# EasyEDA schematic SCH_WatiBattery_2024-12-09.json
TITLE: Sheet_2; REV: 1.0; Date: 2024-12-09; Sheet: 1/1; Drawn By: thomas.fchrr03; Company: Your Company
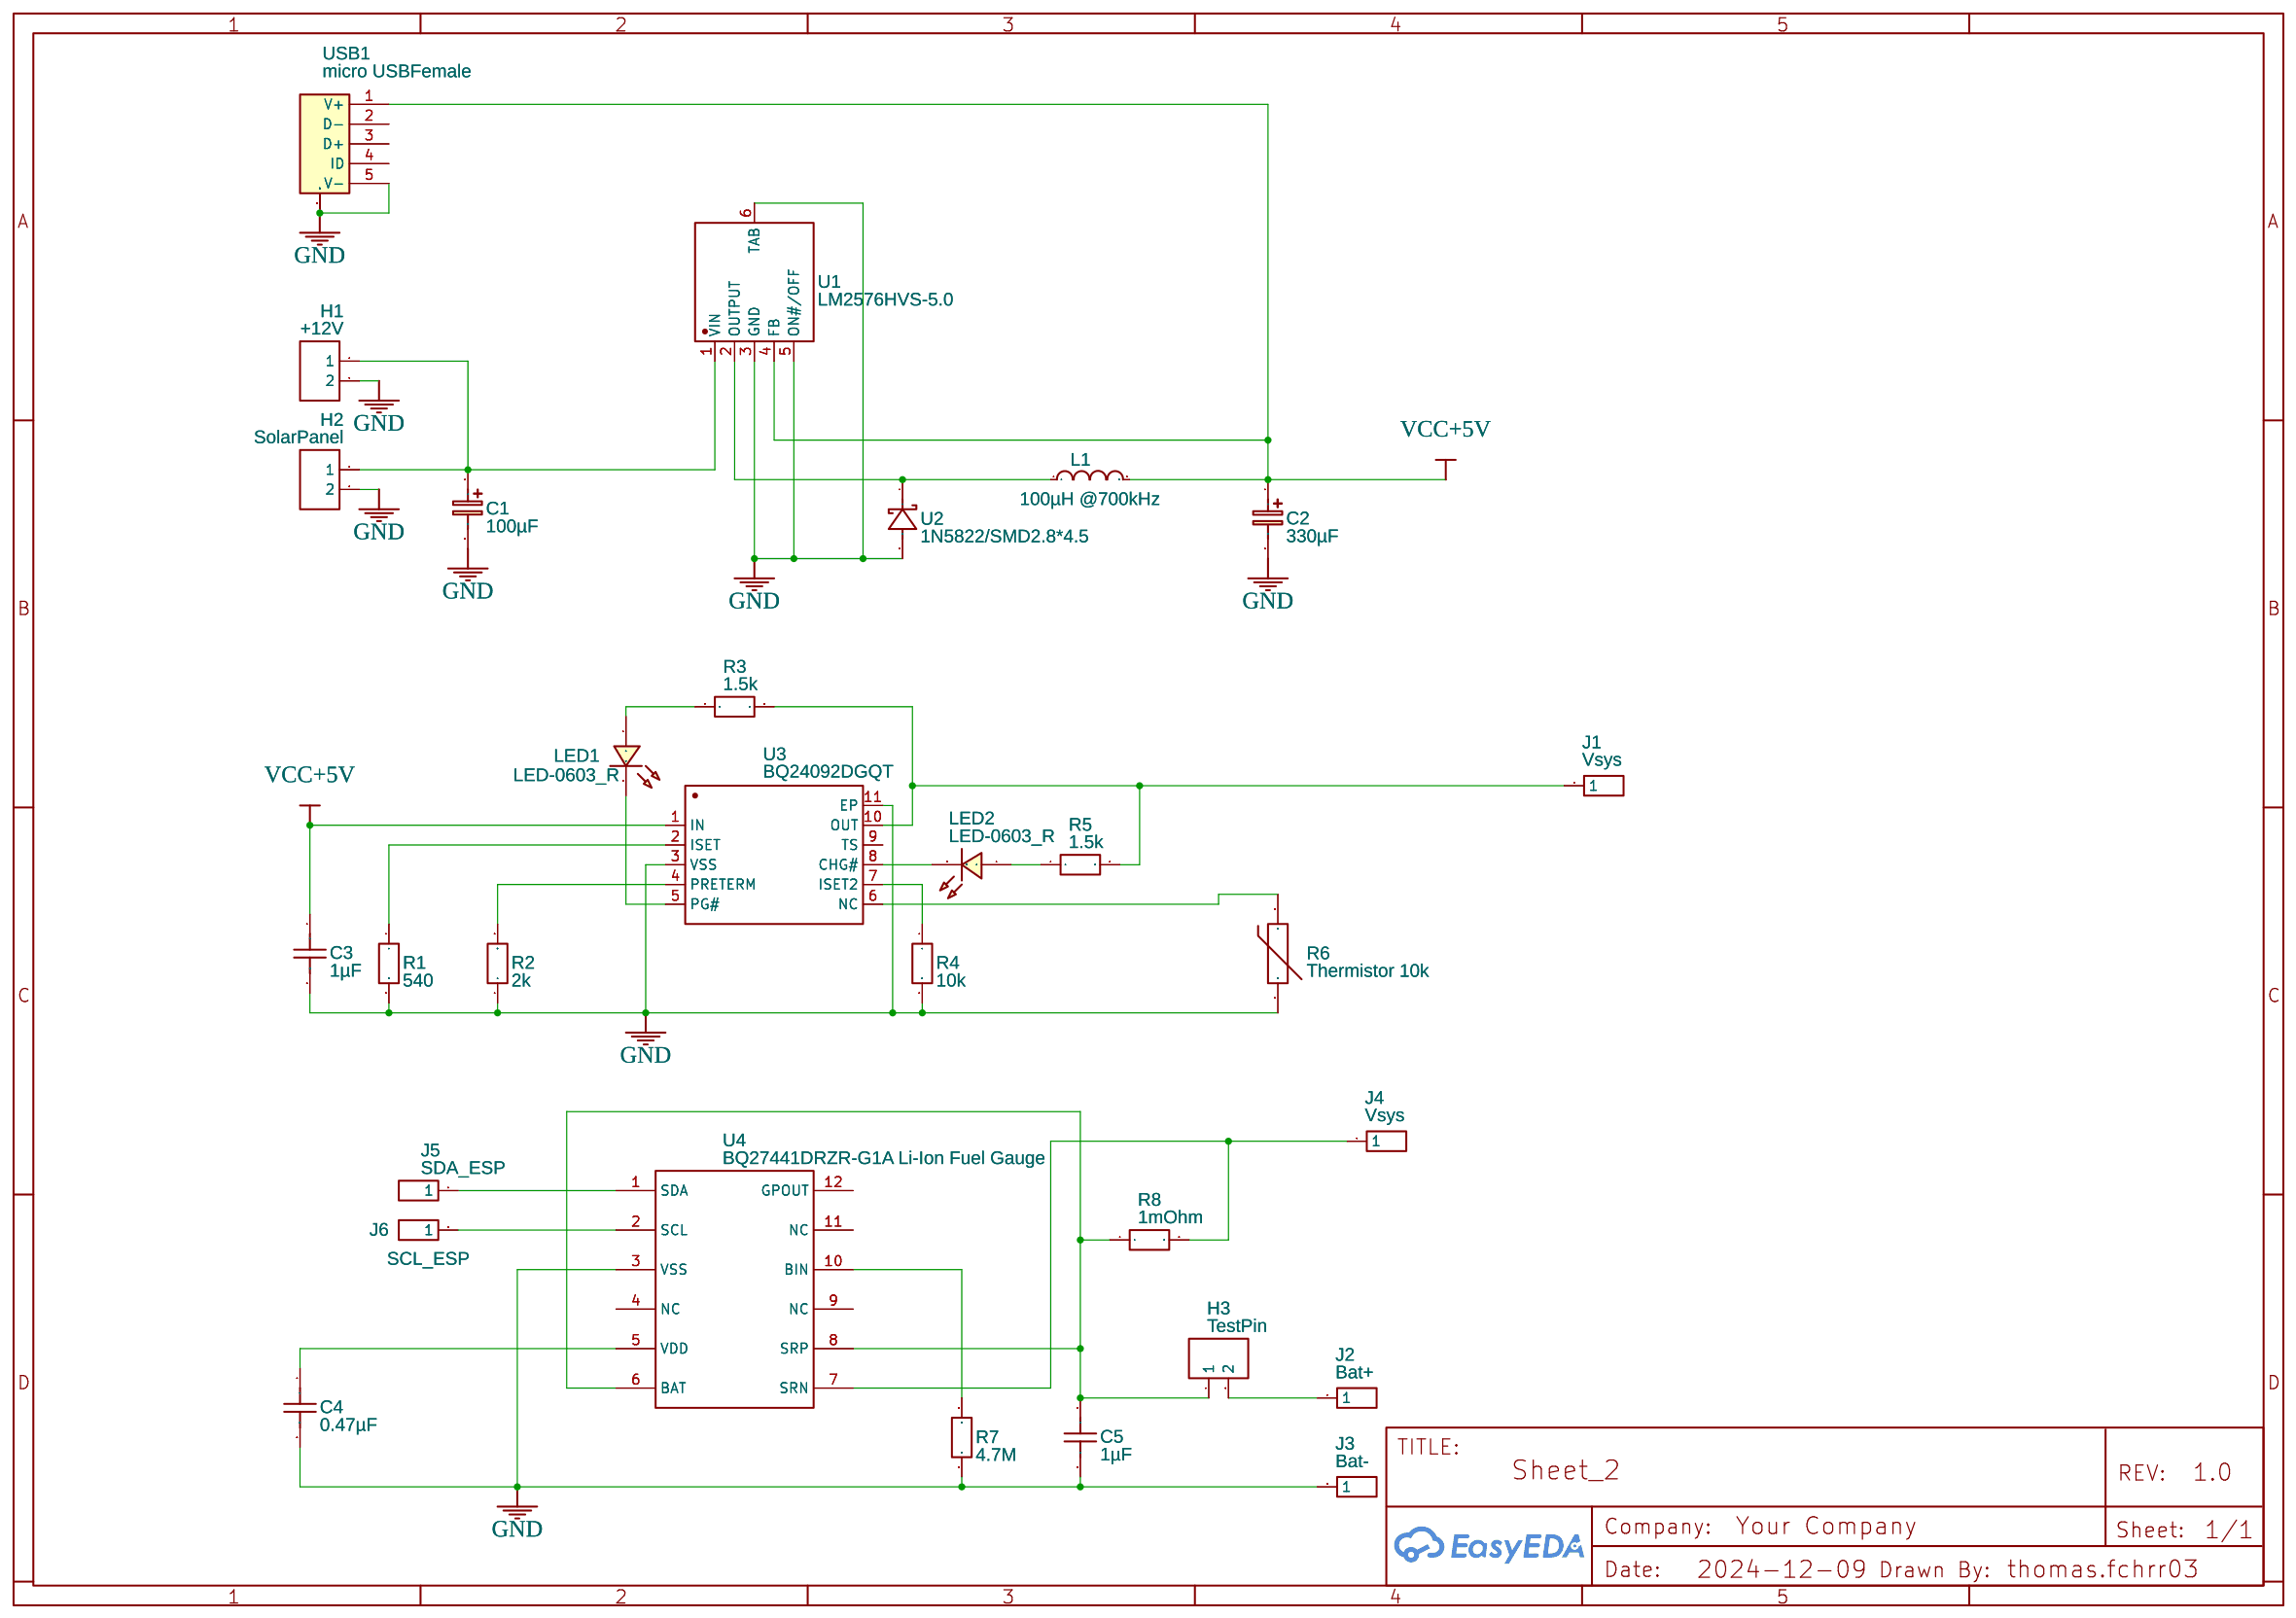
[diagram p0: schematic sheet]

## Parts
C1  100µF  [CASE-A_3216]
C2  330µF  [CASE-A_3216]
C3  1µF  [C0603]
C4  0.47µF  [C0603]
C5  1µF  [C0603]
H1  +12V  [HDR-F-2.54_1X2]
H2  SolarPanel  [HDR-F-2.54_1X2]
H3  TestPin  [HDR-F-2.54_1X2]
J1  Vsys  [HDR-M-2.54_1X1]
J2  Bat+  [HDR-M-2.54_1X1]
J3  Bat-  [HDR-M-2.54_1X1]
J4  Vsys  [HDR-M-2.54_1X1]
J5  SDA_ESP  [HDR-M-2.54_1X1]
J6  SCL_ESP  [HDR-M-2.54_1X1]
L1  100µH @700kHz  [L0603]
LED1  LED-0603_R  [LED0603_RED]
LED2  LED-0603_R  [LED0603_RED]
R1  540  [R0603]
R2  2k  [R0603]
R3  1.5k  [R0603]
R4  10k  [R0603]
R5  1.5k  [R0603]
R6  Thermistor 10k  [RES-TH_L2.5-W2.5-P1.70-D0.3]
R7  4.7M  [R0603]
R8  1mOhm  [R0603]
U1  LM2576HVS-5.0  [PG-TO-263-5_L10.2-W8.7-P1.70-LS14.4-BR]
U2  1N5822/SMD2.8*4.5  [DO-214AC_L4.3-W2.7-LS5.0-RD]
U3  BQ24092DGQT  [HVSSOP-10_L3.0-W3.0-P0.50-LS4.9-BL-EP]
U4  BQ27441DRZR-G1A Li-Ion Fuel Gauge  [BQ27441DRZR-G1A LI-ION FUEL GAUGE]
USB1  micro USBFemale  [MICRO-USB-SMD_5P-P0.65-H-F_C10418]

## Library data of the parts
C1 C2 = C_Tan_SMD_A_EU: Contributor: LCEDA_Lib
C3-C5 = C_0603_US: Contributor: LCEDA_Lib
H1-H3 = HDR-F-2.54_1x2: Supplier Part: C49661; Supplier: LCSC; Contributor: LCEDA_Lib
J1-J6 = HDR-M-2.54_1x1: Supplier Part: C81276; Supplier: LCSC; Contributor: LCEDA_Lib
L1 = L0603_US: Contributor: LCEDA_Lib
LED1 LED2 = LED-0603_R: Manufacturer: EVERLIGHT(台湾亿光); Manufacturer Part: 19-217/R6C-AL1M2VY/3T; Supplier Part: C72044; Supplier: LCSC; Contributor: LCEDA_01
R1-R5 R7 R8 = R_0603_EU: Contributor: LCEDA_Lib
R6 = Thermistance: Supplier: LCSC; Manufacturer: Shiheng; Manufacturer Part: MF52A1502F3470; Supplier Part: C72411; LCSC Assembly: Yes; SMT Type: Extend; Contributor: Montre Med
U1 = LM2576HVS-5.0: JLCPCB Part Class: Extended Part; Contributor: LCSC; Supplier: LCSC; Supplier Part: C347437; Manufacturer: UMW(友台半导体)
U2 = 1N5822/SMD2.8*4.5: Contributor: lcsc; Supplier: LCSC; Supplier Part: C9900015672; Manufacturer: null; JLCPCB Part Class: Extended Part
U3 = BQ24092DGQT: Contributor: LCSC; Supplier: LCSC; Supplier Part: C2864890; Manufacturer: TI(德州仪器); JLCPCB Part Class: Extended Part
U4 = BQ27441DRZR-G1A Li-Ion Fuel Gauge: Contributor: justsmid7
USB1 = micro USBFemale: Supplier: LCSC; Manufacturer: 精拓金; Manufacturer Part: 920-E52A2021S10100; Supplier Part: C10418; JLCPCB Part Class: Extended Part

## Nets
GND: C1.2 C2.2 C3.2 C4.2 C5.2 H1.2 H2.2 J3.1 R1.2 R2.1 R4.2 R6.2 R7.2 U1.3(GND) U1.5(ON#/OFF) U1.6(TAB) U2.2(K) U3.3(VSS) U3.11(EP) U4.3(VSS) USB1.5(V-) USB1.SH0(MTN) USB1.SH1(1) USB1.SH2(2) USB1.SH3(3)
VCC+5V: C2.1 C3.1 L1.2 U1.4(FB) U3.1(IN) USB1.1(V+)
Net-(C1-1): C1.1 H1.1 H2.1 U1.1(VIN)
Net-(C4-1): C4.1 U4.5(VDD)
Net-(C5-1): C5.1 H3.1 R8.1 U4.6(BAT) U4.8(SRP)
Net-(H3-2): H3.2 J2.1
Net-(J1-1): J1.1 R3.2 R5.2 U3.10(OUT)
Net-(J4-1): J4.1 R8.2 U4.7(SRN)
Net-(J5-1): J5.1 U4.1(SDA)
Net-(J6-1): J6.1 U4.2(SCL)
Net-(L1-1): L1.1 U1.2(OUTPUT) U2.1(A)
Net-(LED1-1): LED1.1 R3.1
Net-(LED1-2): LED1.2 U3.5(PG#)
Net-(LED2-1): LED2.1 R5.1
Net-(LED2-2): LED2.2 U3.8(CHG#)
Net-(R1-1): R1.1 U3.2(ISET)
Net-(R2-2): R2.2 U3.4(PRETERM)
Net-(R4-1): R4.1 U3.7(ISET2)
Net-(R6-1): R6.1 U3.6(NC)
Net-(R7-1): R7.1 U4.10(BIN)

Not connected (* = marked no-connect by the designer): U3 9(TS); U4 4(NC) 9(NC) 11(NC) 12(GPOUT); USB1 2(D-) 3(D+) 4(ID)
